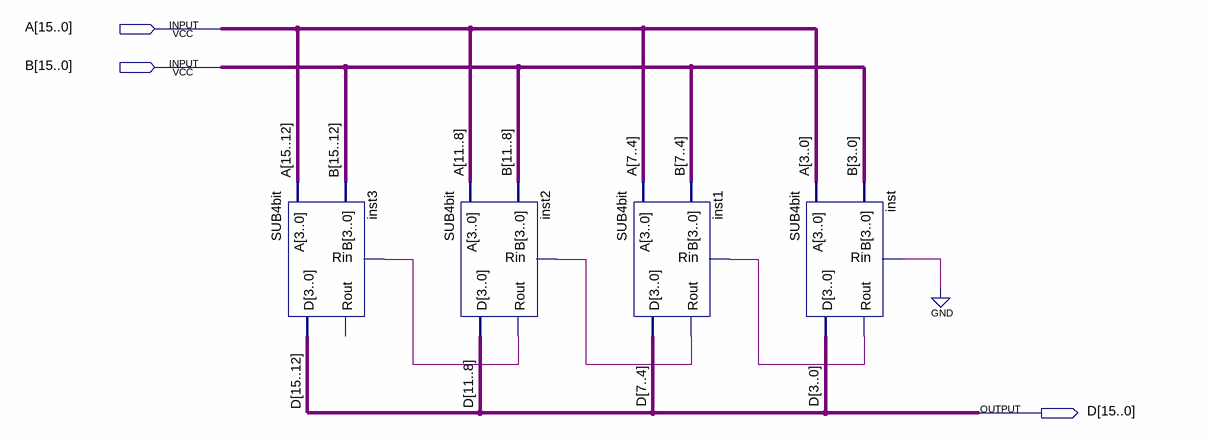
[diagram p0: schematic sheet]
// Quartus schematic SUB16bit.bdf as structural Verilog: 4 symbols, 3 pins
module SUB16bit (
  input  [15:0] A,
  input  [15:0] B,
  output [15:0] D
);

  wire inst1_rout, inst2_rout, inst_rout;

  SUB4bit inst3 (.Rin(inst2_rout), .A(A[15:12]), .B(B[15:12]), .D(D[15:12]));  // open: Rout
  SUB4bit inst2 (.Rin(inst1_rout), .A(A[11:8]), .B(B[11:8]), .D(D[11:8]), .Rout(inst2_rout));
  SUB4bit inst1 (.Rin(inst_rout), .A(A[7:4]), .B(B[7:4]), .D(D[7:4]), .Rout(inst1_rout));
  SUB4bit inst (.Rin(1'b0), .A(A[3:0]), .B(B[3:0]), .D(D[3:0]), .Rout(inst_rout));
endmodule
